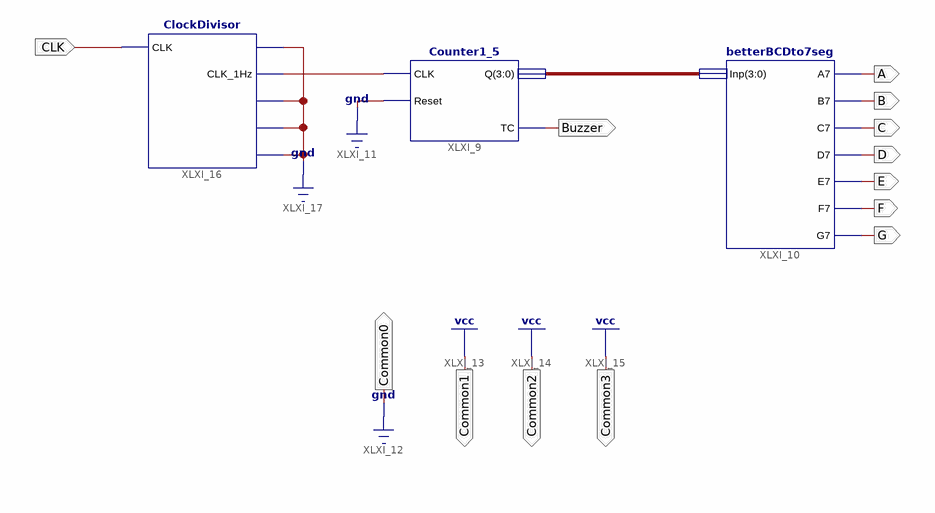
[diagram p0: schematic sheet 1]
// Xilinx ISE schematic main.sch (spartan6) as structural Verilog: 3 symbols, 13 ports
module main (
  input  CLK,
  output Buzzer,
  output Common1,
  output Common2,
  output Common3,
  output Common0,
  output A,
  output B,
  output C,
  output D,
  output E,
  output F,
  output G
);

  wire XLXN_15;
  wire [3:0] XLXN_23;

  Counter1_5 XLXI_9 (.CLK(XLXN_15), .Reset(1'b0), .Q(XLXN_23), .TC(Buzzer));
  betterBCDto7seg XLXI_10 (.Inp(XLXN_23), .A7(A), .B7(B), .C7(C), .D7(D), .E7(E), .F7(F), .G7(G));
  ClockDivisor XLXI_16 (
    .CLK(CLK), .CLK_2Hz(1'b0), .CLK_1Hz(XLXN_15), .CLK_10Hz(1'b0), .CLK_100Hz(1'b0), .CLK_1000Hz(1'b0));

  assign Common0 = 1'b0;
  assign Common1 = 1'b1;
  assign Common2 = 1'b1;
  assign Common3 = 1'b1;
endmodule
